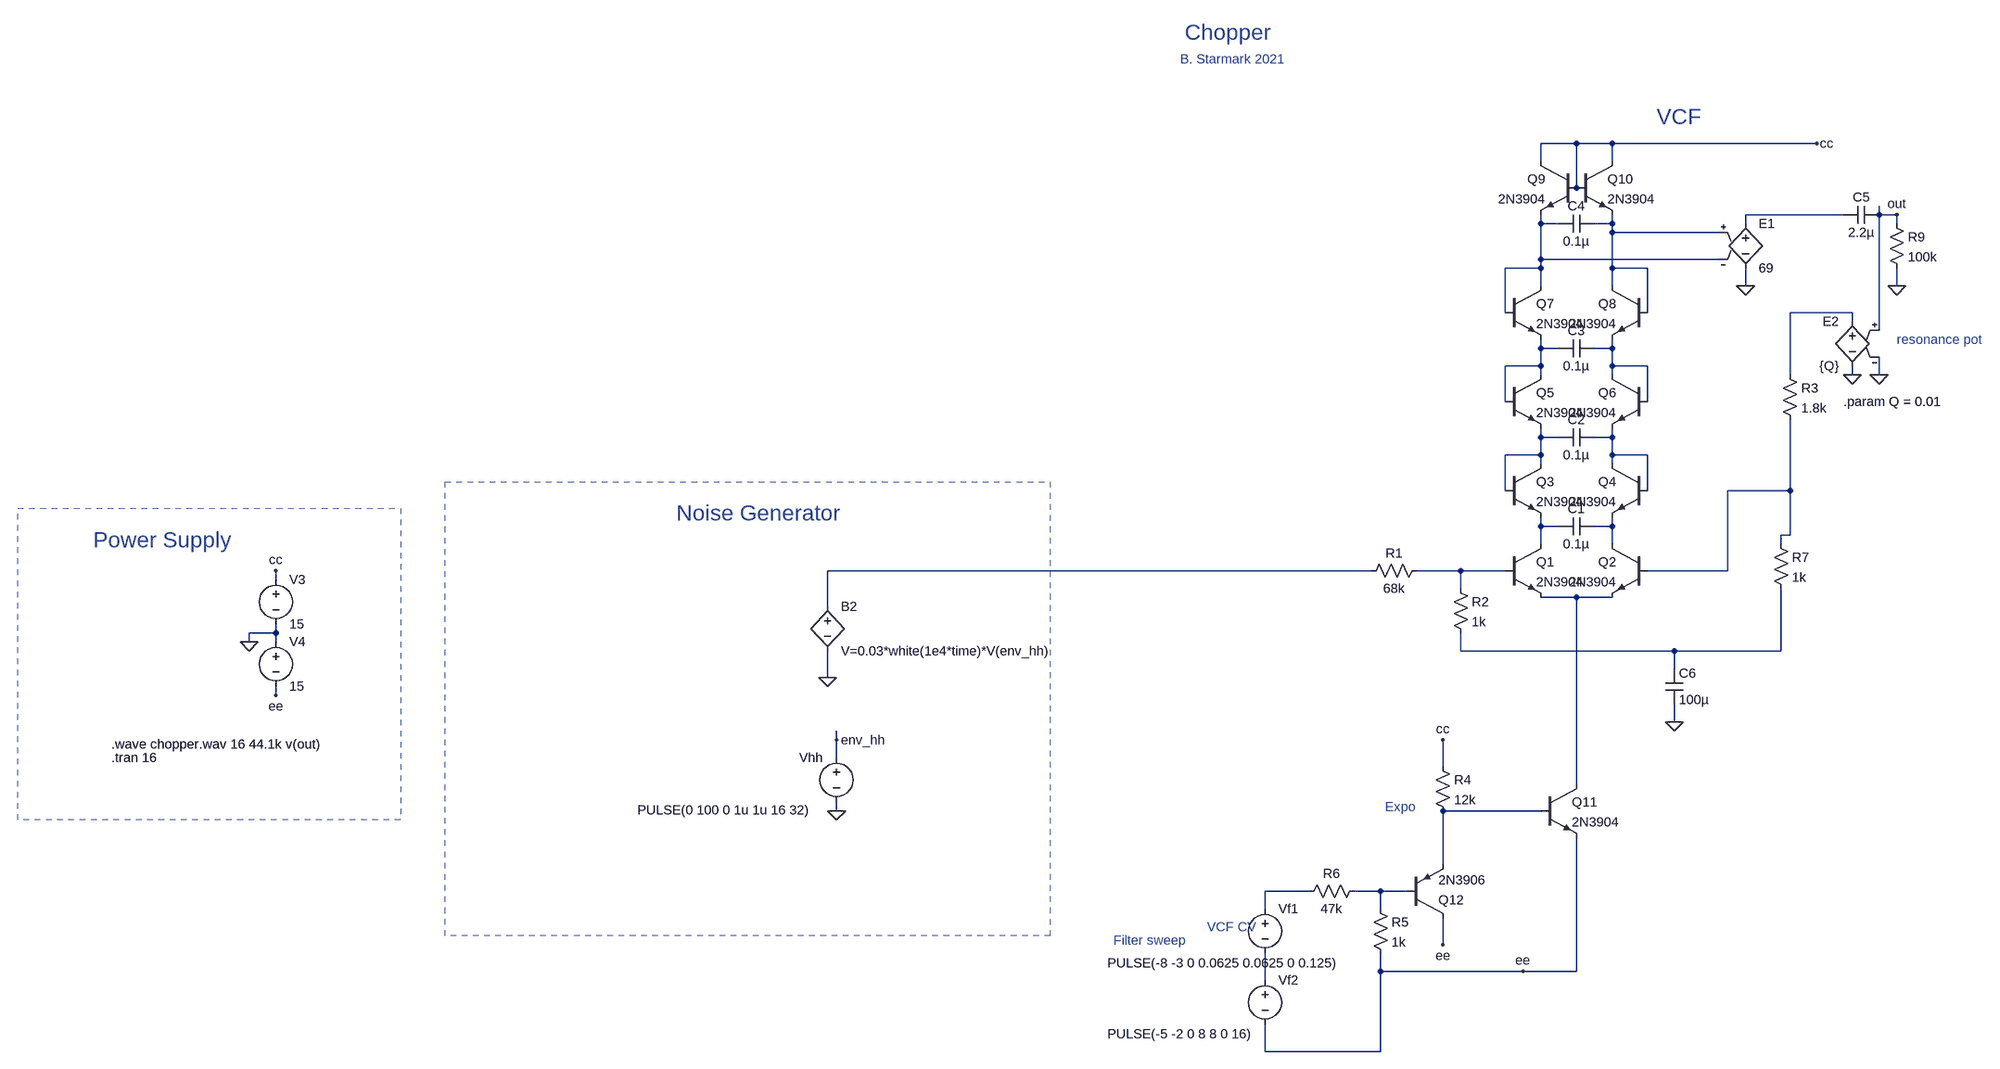
[diagram p0: schematic chopper.asc]
chopper.asc, the LTspice schematic file:
Version 4
SHEET 1 1536 2476
WIRE 272 -752 208 -752
WIRE 336 -752 272 -752
WIRE 704 -752 336 -752
WIRE 208 -720 208 -752
WIRE 336 -720 336 -752
WIRE 272 -672 272 -752
WIRE 752 -624 576 -624
WIRE 816 -624 816 -640
WIRE 848 -624 816 -624
WIRE 208 -608 208 -624
WIRE 240 -608 208 -608
WIRE 336 -608 336 -624
WIRE 336 -608 304 -608
WIRE 576 -608 576 -624
WIRE 848 -608 848 -624
WIRE 336 -592 336 -608
WIRE 528 -592 336 -592
WIRE 208 -544 208 -608
WIRE 528 -544 208 -544
WIRE 208 -528 208 -544
WIRE 208 -528 144 -528
WIRE 336 -528 336 -592
WIRE 400 -528 336 -528
WIRE 208 -496 208 -528
WIRE 336 -496 336 -528
WIRE 576 -496 576 -528
WIRE 848 -496 848 -528
WIRE 144 -448 144 -528
WIRE 400 -448 400 -528
WIRE 768 -448 656 -448
WIRE 768 -432 768 -448
WIRE 816 -416 816 -624
WIRE 208 -384 208 -400
WIRE 240 -384 208 -384
WIRE 336 -384 336 -400
WIRE 336 -384 304 -384
WIRE 208 -352 208 -384
WIRE 208 -352 144 -352
WIRE 336 -352 336 -384
WIRE 400 -352 336 -352
WIRE 208 -336 208 -352
WIRE 336 -336 336 -352
WIRE 656 -336 656 -448
WIRE 768 -336 768 -352
WIRE 816 -336 816 -368
WIRE 144 -288 144 -352
WIRE 400 -288 400 -352
WIRE 208 -224 208 -240
WIRE 240 -224 208 -224
WIRE 336 -224 336 -240
WIRE 336 -224 304 -224
WIRE 208 -192 208 -224
WIRE 208 -192 144 -192
WIRE 336 -192 336 -224
WIRE 400 -192 336 -192
WIRE 208 -176 208 -192
WIRE 336 -176 336 -192
WIRE 144 -128 144 -192
WIRE 400 -128 400 -192
WIRE 656 -128 656 -256
WIRE 656 -128 544 -128
WIRE 208 -64 208 -80
WIRE 240 -64 208 -64
WIRE 336 -64 336 -80
WIRE 336 -64 304 -64
WIRE 656 -48 656 -128
WIRE 656 -48 640 -48
WIRE 208 -32 208 -64
WIRE 336 -32 336 -64
WIRE 640 -32 640 -48
WIRE -96 16 -1216 16
WIRE 64 16 -16 16
WIRE 144 16 64 16
WIRE 544 16 544 -128
WIRE 544 16 400 16
WIRE -2208 32 -2208 16
WIRE 64 48 64 16
WIRE 272 64 208 64
WIRE 336 64 272 64
WIRE -1216 80 -1216 16
WIRE -2208 128 -2208 112
WIRE -2208 128 -2256 128
WIRE -2256 144 -2256 128
WIRE -2208 144 -2208 128
WIRE 64 160 64 128
WIRE 448 160 64 160
WIRE 640 160 640 48
WIRE 640 160 448 160
WIRE 448 192 448 160
WIRE -1216 208 -1216 160
WIRE -2208 240 -2208 224
WIRE 448 288 448 256
WIRE -1200 320 -1200 304
WIRE -1200 352 -1200 320
WIRE 32 368 32 320
WIRE 272 400 272 64
WIRE -1200 448 -1200 432
WIRE 208 448 32 448
WIRE 32 544 32 448
WIRE -208 592 -288 592
WIRE -80 592 -128 592
WIRE -32 592 -80 592
WIRE -288 624 -288 592
WIRE -80 624 -80 592
WIRE 32 688 32 640
WIRE -80 736 -80 704
WIRE 176 736 -80 736
WIRE 272 736 272 496
WIRE 272 736 176 736
WIRE -288 752 -288 704
WIRE -288 880 -288 832
WIRE -80 880 -80 736
WIRE -80 880 -288 880
FLAG -2256 144 0
FLAG -2208 240 ee
FLAG -2208 16 cc
FLAG 704 -752 cc
FLAG 848 -496 0
FLAG 576 -496 0
FLAG 32 320 cc
FLAG 32 688 ee
FLAG 176 736 ee
FLAG 816 -336 0
FLAG 768 -336 0
FLAG 448 288 0
FLAG -1200 448 0
FLAG -1216 208 0
FLAG 848 -624 out
FLAG -1200 320 env_hh
SYMBOL voltage -2208 16 R0
SYMATTR InstName V3
SYMATTR Value 15
SYMBOL voltage -2208 128 R0
SYMATTR InstName V4
SYMATTR Value 15
SYMBOL npn 144 -32 R0
SYMATTR InstName Q1
SYMATTR Value 2N3904
SYMBOL npn 400 -32 M0
SYMATTR InstName Q2
SYMATTR Value 2N3904
SYMBOL cap 304 -80 R90
WINDOW 0 0 32 VBottom 2
WINDOW 3 32 32 VTop 2
SYMATTR InstName C1
SYMATTR Value 0.1µ
SYMBOL npn 144 -176 R0
SYMATTR InstName Q3
SYMATTR Value 2N3904
SYMBOL npn 400 -176 M0
SYMATTR InstName Q4
SYMATTR Value 2N3904
SYMBOL cap 304 -240 R90
WINDOW 0 0 32 VBottom 2
WINDOW 3 32 32 VTop 2
SYMATTR InstName C2
SYMATTR Value 0.1µ
SYMBOL npn 144 -336 R0
SYMATTR InstName Q5
SYMATTR Value 2N3904
SYMBOL npn 400 -336 M0
SYMATTR InstName Q6
SYMATTR Value 2N3904
SYMBOL cap 304 -400 R90
WINDOW 0 0 32 VBottom 2
WINDOW 3 32 32 VTop 2
SYMATTR InstName C3
SYMATTR Value 0.1µ
SYMBOL npn 144 -496 R0
SYMATTR InstName Q7
SYMATTR Value 2N3904
SYMBOL npn 400 -496 M0
SYMATTR InstName Q8
SYMATTR Value 2N3904
SYMBOL cap 304 -624 R90
WINDOW 0 0 32 VBottom 2
WINDOW 3 32 32 VTop 2
SYMATTR InstName C4
SYMATTR Value 0.1µ
SYMBOL npn 272 -720 M0
SYMATTR InstName Q9
SYMATTR Value 2N3904
SYMBOL npn 272 -720 R0
SYMATTR InstName Q10
SYMATTR Value 2N3904
SYMBOL cap 752 -608 R270
WINDOW 0 32 32 VTop 2
WINDOW 3 0 32 VBottom 2
SYMATTR InstName C5
SYMATTR Value 2.2µ
SYMBOL res 832 -624 R0
SYMATTR InstName R9
SYMATTR Value 100k
SYMBOL e 576 -624 R0
SYMATTR InstName E1
SYMATTR Value 69
SYMBOL res 0 0 R90
WINDOW 0 0 56 VBottom 2
WINDOW 3 32 56 VTop 2
SYMATTR InstName R1
SYMATTR Value 68k
SYMBOL res 48 32 R0
SYMATTR InstName R2
SYMATTR Value 1k
SYMBOL npn 208 400 R0
SYMATTR InstName Q11
SYMATTR Value 2N3904
SYMBOL pnp -32 640 M180
SYMATTR InstName Q12
SYMATTR Value 2N3906
SYMBOL res 16 352 R0
SYMATTR InstName R4
SYMATTR Value 12k
SYMBOL res -96 608 R0
SYMATTR InstName R5
SYMATTR Value 1k
SYMBOL res -112 576 R90
WINDOW 0 0 56 VBottom 2
WINDOW 3 32 56 VTop 2
SYMATTR InstName R6
SYMATTR Value 47k
SYMBOL voltage -288 608 R0
WINDOW 123 0 0 Left 0
WINDOW 39 0 0 Left 0
WINDOW 3 -283 113 Left 2
SYMATTR Value PULSE(-8 -3 0 0.0625 0.0625 0 0.125)
SYMATTR InstName Vf1
SYMBOL e 768 -448 M0
SYMATTR InstName E2
SYMATTR Value {Q}
SYMBOL res 640 -352 R0
SYMATTR InstName R3
SYMATTR Value 1.8k
SYMBOL res 624 -48 R0
SYMATTR InstName R7
SYMATTR Value 1k
SYMBOL cap 432 192 R0
SYMATTR InstName C6
SYMATTR Value 100µ
SYMBOL voltage -1200 336 M0
WINDOW 123 24 124 Left 2
WINDOW 39 0 0 Left 2
WINDOW 3 47 110 Left 2
SYMATTR Value PULSE(0 100 0 1u 1u 16 32)
SYMATTR InstName Vhh
SYMBOL bv -1216 64 R0
SYMATTR InstName B2
SYMATTR Value V=0.03*white(1e4*time)*V(env_hh)
SYMBOL voltage -288 736 R0
WINDOW 123 0 0 Left 0
WINDOW 39 0 0 Left 0
WINDOW 3 -283 113 Left 2
SYMATTR Value PULSE(-5 -2 0 8 8 0 16)
SYMATTR InstName Vf2
TEXT -2504 352 Left 2 !.tran 16
TEXT -432 -952 Left 4 ;Chopper
TEXT -2504 328 Left 2 !.wave chopper.wav 16 44.1k v(out)
TEXT 848 -400 Left 2 ;resonance pot
TEXT 752 -288 Left 2 !.param Q = 0.01
TEXT -1488 -88 Left 4 ;Noise Generator
TEXT -560 680 Left 2 ;Filter sweep
TEXT 416 -800 Left 4 ;VCF
TEXT -2536 -40 Left 4 ;Power Supply
TEXT -72 440 Left 2 ;Expo
TEXT -392 656 Left 2 ;VCF CV
TEXT -440 -904 Left 2 ;B. Starmark 2021
RECTANGLE Normal -816 672 -1904 -144 2
RECTANGLE Normal -1984 464 -2672 -96 2

The netlist it stands for:
* chopper.asc
V3 cc 0 15
V4 0 ee 15
Q1 N010 N013 N014 0 2N3904
Q2 N011 N009 N014 0 2N3904
C1 N011 N010 0.1µ
Q3 N007 N007 N010 0 2N3904
Q4 N008 N008 N011 0 2N3904
C2 N008 N007 0.1µ
Q5 N005 N005 N007 0 2N3904
Q6 N006 N006 N008 0 2N3904
C3 N006 N005 0.1µ
Q7 N002 N002 N005 0 2N3904
Q8 N003 N003 N006 0 2N3904
C4 N003 N002 0.1µ
Q9 cc cc N002 0 2N3904
Q10 cc cc N003 0 2N3904
C5 N001 out 2.2µ
R9 out 0 100k
E1 N001 0 N003 N002 69
R1 N013 N012 68k
R2 N013 N015 1k
Q11 N014 N016 ee 0 2N3904
Q12 ee N018 N016 0 2N3906
R4 cc N016 12k
R5 N018 ee 1k
R6 N018 N017 47k
Vf1 N017 N019 PULSE(-8 -3 0 0.0625 0.0625 0 0.125)
E2 N004 0 out 0 {Q}
R3 N004 N009 1.8k
R7 N009 N015 1k
C6 N015 0 100µ
Vhh env_hh 0 PULSE(0 100 0 1u 1u 16 32)
B2 N012 0 V=0.03*white(1e4*time)*V(env_hh)
Vf2 N019 ee PULSE(-5 -2 0 8 8 0 16)
.model NPN NPN
.model PNP PNP
.lib standard.bjt
.tran 16
* Chopper
.wave chopper.wav 16 44.1k v(out)
* resonance pot
.param Q = 0.01
* Noise Generator
* Filter sweep
* VCF
* Power Supply
* Expo
* VCF CV
* B. Starmark 2021
.backanno
.end